# EAGLE schematic delay_panel (EAGLE 9.4.2)
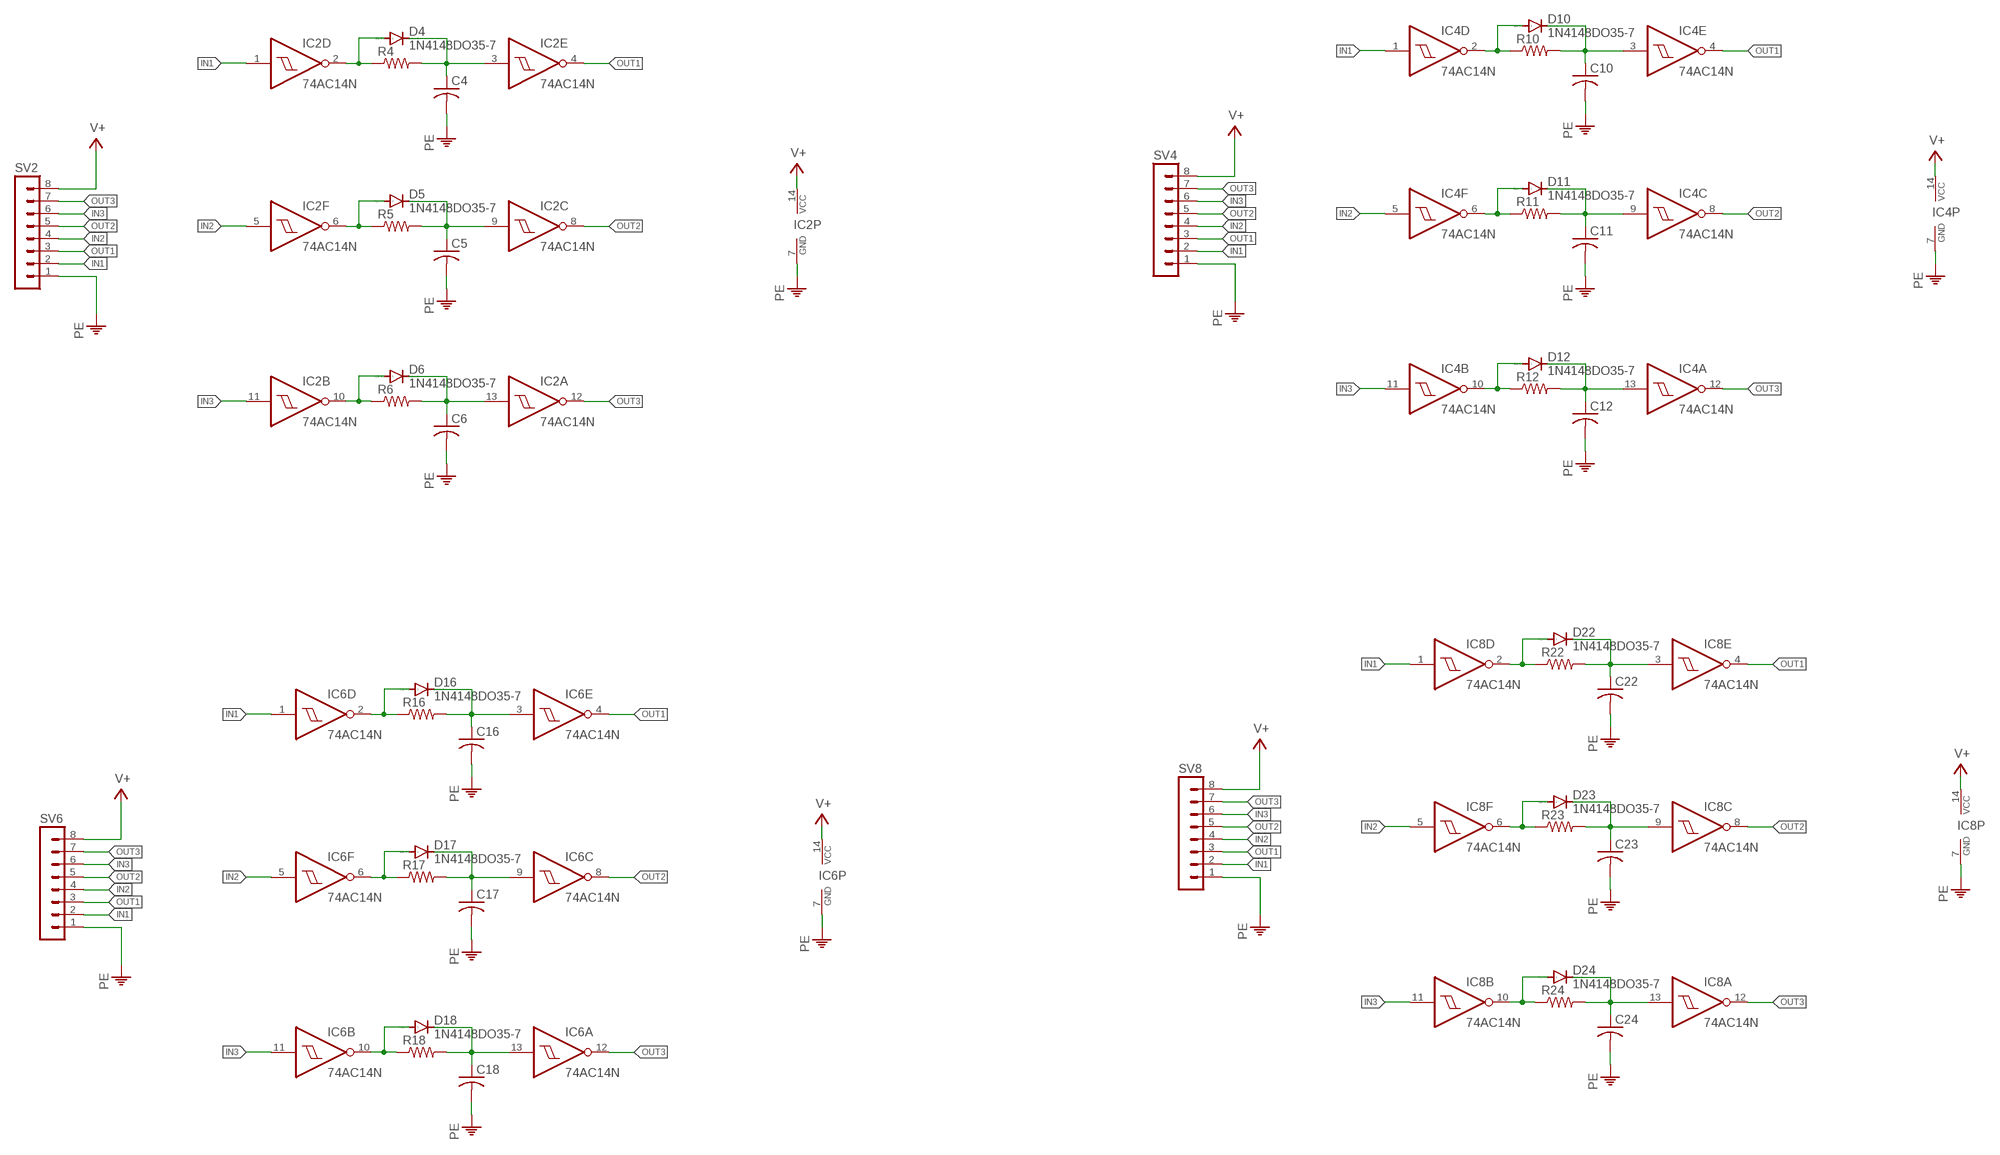
[diagram p0: schematic, sheet 1]

## Parts
C4  C-US025-025X050  [C025-025X050]
C5  C-US025-025X050  [C025-025X050]
C6  C-US025-025X050  [C025-025X050]
C10  C-US025-025X050  [C025-025X050]
C11  C-US025-025X050  [C025-025X050]
C12  C-US025-025X050  [C025-025X050]
C16  C-US025-025X050  [C025-025X050]
C17  C-US025-025X050  [C025-025X050]
C18  C-US025-025X050  [C025-025X050]
C22  C-US025-025X050  [C025-025X050]
C23  C-US025-025X050  [C025-025X050]
C24  C-US025-025X050  [C025-025X050]
D4  1N4148DO35-7  [DO35-7]
D5  1N4148DO35-7  [DO35-7]
D6  1N4148DO35-7  [DO35-7]
D10  1N4148DO35-7  [DO35-7]
D11  1N4148DO35-7  [DO35-7]
D12  1N4148DO35-7  [DO35-7]
D16  1N4148DO35-7  [DO35-7]
D17  1N4148DO35-7  [DO35-7]
D18  1N4148DO35-7  [DO35-7]
D22  1N4148DO35-7  [DO35-7]
D23  1N4148DO35-7  [DO35-7]
D24  1N4148DO35-7  [DO35-7]
IC2  74AC14N  [DIL14]
IC4  74AC14N  [DIL14]
IC6  74AC14N  [DIL14]
IC8  74AC14N  [DIL14]
R4  R-US_0204/7  [0204/7]
R5  R-US_0204/7  [0204/7]
R6  R-US_0204/7  [0204/7]
R10  R-US_0204/7  [0204/7]
R11  R-US_0204/7  [0204/7]
R12  R-US_0204/7  [0204/7]
R16  R-US_0204/7  [0204/7]
R17  R-US_0204/7  [0204/7]
R18  R-US_0204/7  [0204/7]
R22  R-US_0204/7  [0204/7]
R23  R-US_0204/7  [0204/7]
R24  R-US_0204/7  [0204/7]
SV2  MA08-1  [MA08-1]
SV4  MA08-1  [MA08-1]
SV6  MA08-1  [MA08-1]
SV8  MA08-1  [MA08-1]

## Nets
IN1: IC2.1(D:I) IC4.1(D:I) IC6.1(D:I) IC8.1(D:I) SV2.2 SV4.2 SV6.2 SV8.2
IN2: IC2.5(F:I) IC4.5(F:I) IC6.5(F:I) IC8.5(F:I) SV2.4 SV4.4 SV6.4 SV8.4
IN3: IC2.11(B:I) IC4.11(B:I) IC6.11(B:I) IC8.11(B:I) SV2.6 SV4.6 SV6.6 SV8.6
N$4: C4.1 D4.C IC2.3(E:I) R4.2
N$5: D4.A IC2.2(D:O) R4.1
N$9: C5.1 D5.C IC2.9(C:I) R5.2
N$10: D5.A IC2.6(F:O) R5.1
N$11: C6.1 D6.C IC2.13(A:I) R6.2
N$12: D6.A IC2.10(B:O) R6.1
N$19: C10.1 D10.C IC4.3(E:I) R10.2
N$20: D10.A IC4.2(D:O) R10.1
N$21: C11.1 D11.C IC4.9(C:I) R11.2
N$22: D11.A IC4.6(F:O) R11.1
N$23: C12.1 D12.C IC4.13(A:I) R12.2
N$24: D12.A IC4.10(B:O) R12.1
N$31: C16.1 D16.C IC6.3(E:I) R16.2
N$32: D16.A IC6.2(D:O) R16.1
N$33: C17.1 D17.C IC6.9(C:I) R17.2
N$34: D17.A IC6.6(F:O) R17.1
N$35: C18.1 D18.C IC6.13(A:I) R18.2
N$36: D18.A IC6.10(B:O) R18.1
N$43: C22.1 D22.C IC8.3(E:I) R22.2
N$44: D22.A IC8.2(D:O) R22.1
N$45: C23.1 D23.C IC8.9(C:I) R23.2
N$46: D23.A IC8.6(F:O) R23.1
N$47: C24.1 D24.C IC8.13(A:I) R24.2
N$48: D24.A IC8.10(B:O) R24.1
OUT1: IC2.4(E:O) IC4.4(E:O) IC6.4(E:O) IC8.4(E:O) SV2.3 SV4.3 SV6.3 SV8.3
OUT2: IC2.8(C:O) IC4.8(C:O) IC6.8(C:O) IC8.8(C:O) SV2.5 SV4.5 SV6.5 SV8.5
OUT3: IC2.12(A:O) IC4.12(A:O) IC6.12(A:O) IC8.12(A:O) SV2.7 SV4.7 SV6.7 SV8.7
PE: C4.2 C5.2 C6.2 C10.2 C11.2 C12.2 C16.2 C17.2 C18.2 C22.2 C23.2 C24.2 IC2.7(P:GND) IC4.7(P:GND) IC6.7(P:GND) IC8.7(P:GND) SV2.1 SV4.1 SV6.1 SV8.1
V+: IC2.14(P:VCC) IC4.14(P:VCC) IC6.14(P:VCC) IC8.14(P:VCC) SV2.8 SV4.8 SV6.8 SV8.8

## Library data of the parts
C4-C6 C10-C12 C16-C18 C22-C24 = rcl:C-US: CAPACITOR, American symbol; SPICEPREFIX: C
D4-D6 D10-D12 D16-D18 D22-D24 = diode:1N4148: DIODE high speed (Philips)
IC2 IC4 IC6 IC8 = 74xx-eu:74*14: Hex schmitt trigger INVERTER
R4-R6 R10-R12 R16-R18 R22-R24 = rcl:R-US_: RESISTOR, American symbol; SPICEPREFIX: R
SV2 SV4 SV6 SV8 = con-lstb:MA08-1: PIN HEADER; OC_FARNELL: unknown; OC_NEWARK: unknown